# Altium schematic sheet MCU_STM32L051.SchDoc
size A4; SheetNumber: 3; SheetTotal: 7
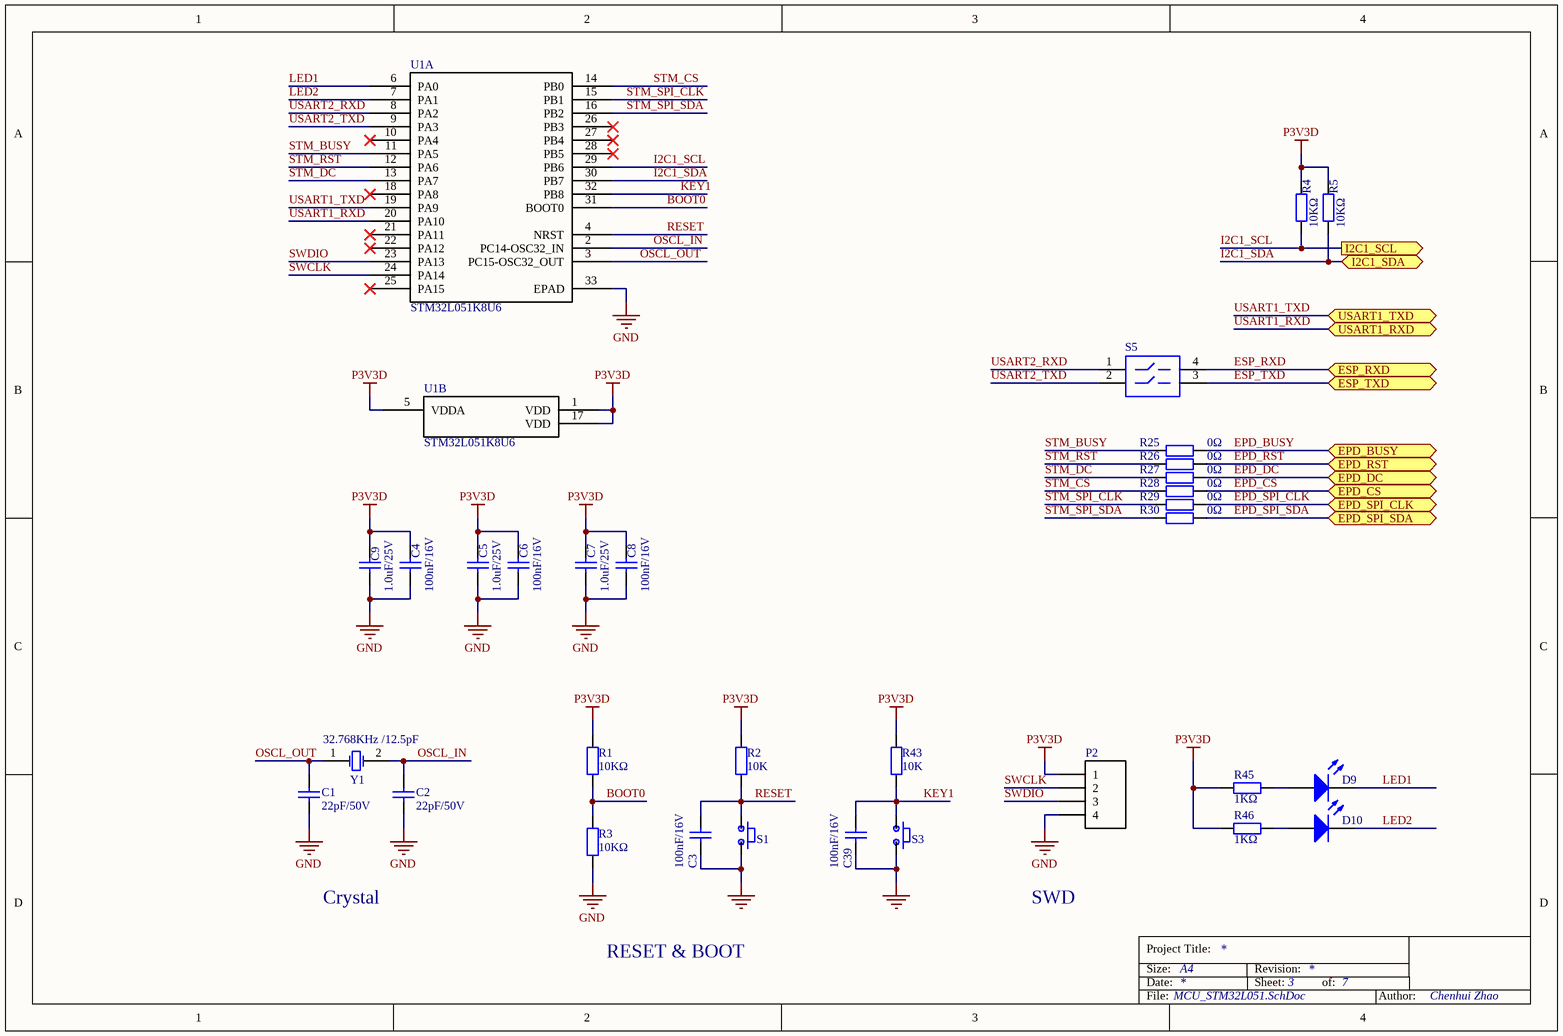
[diagram p0: MCU_STM32L051.SchDoc]

## Parts
C1  22pF/50V  [0402_C]
C2  22pF/50V  [0402_C]
C3  100nF/16V  [0402_C]
C4  100nF/16V  [0402_C]
C5  1.0uF/25V  [0402_C]
C6  100nF/16V  [0402_C]
C7  1.0uF/25V  [0402_C]
C8  100nF/16V  [0402_C]
C9  1.0uF/25V  [0402_C]
C39  100nF/16V  [0402_C]
D9  蓝灯 0603  [0603_LED_S1]  (value not drawn)
D10  蓝灯 0603  [0603_LED_S1]  (value not drawn)
P2  Header 4  [DIP4-2.00]  (value not drawn)
R1  10KΩ  [0402_R]
R2  10K  [0402_R]
R3  10KΩ  [0402_R]
R4  10KΩ  [0402_R]
R5  10KΩ  [0402_R]
R25  0Ω  [0402_R]
R26  0Ω  [0402_R]
R27  0Ω  [0402_R]
R28  0Ω  [0402_R]
R29  0Ω  [0402_R]
R30  0Ω  [0402_R]
R43  10K  [0402_R]
R45  1KΩ  [0402_R]
R46  1KΩ  [0402_R]
S1  Button  [SKRKAHE020]  (value not drawn)
S3  Button  [SKRKAHE020]  (value not drawn)
S5  拨码开关  [SW_SMT4]  (value not drawn)
U1  STM32L051K8U6  [UFQFPN32-5x5mm]  (parts A,B of 2)
Y1  32.768KHz /12.5pF  [SMD-3215_2P FC - 135]

## Ports
EPD_BUSY (bidir), EPD_CS (bidir), EPD_DC (bidir), EPD_RST (bidir), EPD_SPI_CLK (bidir), EPD_SPI_SDA (bidir), ESP_RXD (bidir), ESP_TXD (bidir), I2C1_SCL (out), I2C1_SDA (bidir), USART1_RXD (bidir), USART1_TXD (bidir)

## Nets
GND: C1.1 C2.1 C3.1 C4.1 C5.1 C6.1 C7.1 C8.1 C9.1 C39.1 P2.4 R3.1 S1.2 S3.2 U1.33(EPAD)
P3V3D: C4.2 C5.2 C6.2 C7.2 C8.2 C9.2 P2.1 R1.2 R2.2 R4.2 R5.2 R43.2 R45.2 R46.2 U1.1(VDD) U1.5(VDDA) U1.17(VDD)
BOOT0: R1.1 R3.2 U1.31(BOOT0)
EPD_BUSY: R25.2 ; port EPD_BUSY
EPD_CS: R28.2 ; port EPD_CS
EPD_DC: R27.2 ; port EPD_DC
EPD_RST: R26.2 ; port EPD_RST
EPD_SPI_CLK: R29.2 ; port EPD_SPI_CLK
EPD_SPI_SDA: R30.2 ; port EPD_SPI_SDA
ESP_RXD: S5.4 ; port ESP_RXD
ESP_TXD: S5.3 ; port ESP_TXD
I2C1_SCL: R4.1 U1.29(PB6) ; port I2C1_SCL
I2C1_SDA: R5.1 U1.30(PB7) ; port I2C1_SDA
KEY1: C39.2 R43.1 S3.1 U1.32(PB8)
LED1: D9.K U1.6(PA0)
LED2: D10.K U1.7(PA1)
OSCL_IN: C2.2 U1.2(PC14-OSC32_IN) Y1.2(OSC2)
OSCL_OUT: C1.2 U1.3(PC15-OSC32_OUT) Y1.1(OSC1)
RESET: C3.2 R2.1 S1.1 U1.4(NRST)
STM_BUSY: R25.1 U1.11(PA5)
STM_CS: R28.1 U1.14(PB0)
STM_DC: R27.1 U1.13(PA7)
STM_RST: R26.1 U1.12(PA6)
STM_SPI_CLK: R29.1 U1.15(PB1)
STM_SPI_SDA: R30.1 U1.16(PB2)
SWCLK: P2.2 U1.24(PA14)
SWDIO: P2.3 U1.23(PA13)
USART1_RXD: U1.20(PA10) ; port USART1_RXD
USART1_TXD: U1.19(PA9) ; port USART1_TXD
USART2_RXD: S5.1 U1.8(PA2)
USART2_TXD: S5.2 U1.9(PA3)
NetD9_A: D9.A R45.1
NetD10_A: D10.A R46.1

Not connected (* = marked no-connect by the designer): U1 10(PA4)* 18(PA8)* 21(PA11)* 22(PA12)* 25(PA15)* 26(PB3)* 27(PB4)* 28(PB5)*

## Notes on the sheet
- Crystal
- SWD
- RESET & BOOT
- Date:
- Size:
- Project Title:
- A4
- Revision:
- Sheet:
- of:
- File:
- Author:
- Chenhui Zhao

## Library data of the parts
C1 C2 = 0402 22pF (220) 5% 50V: 贴片电容; ComponentLink1Description: 供应商链接; ComponentLink1URL: http://www.szlcsc.com/product/details_1907.html; Package: 0402; Supplier: LC; SuppliersPartNumber: C1555
C3 C4 C6 C8 C39 = 0402 100nF (104) 10% 16V: 贴片电容; ComponentLink1Description: 供应商链接; ComponentLink1URL: http://www.szlcsc.com/product/details_1877.html; Package: 0402; Supplier: LC; SuppliersPartNumber: C1525
C5 C7 C9 = 0402 1.0uF (105) 10% 25V: 贴片电容; ComponentLink1Description: 供应商链接; ComponentLink1URL: http://www.szlcsc.com/product/details_53938.html; Package: 0402; Supplier: LC; SuppliersPartNumber: C52923
D9 D10 = 0603 蓝灯: 发光二极管; ComponentLink1Description: 供应商链接; ComponentLink1URL: http://www.szlcsc.com/product/details_73150.html; Package: 0603; Supplier: LC; SuppliersPartNumber: C72041
P2 = Header 4: Header, 4-Pin; LatestRevisionDate: 17-Jul-2002; LatestRevisionNote: Re-released for DXP Platform.; Publisher: Altium Limited
R1-R5 R43 = 0402 10KΩ (1002) 1%: 贴片电阻; ComponentLink1Description: 供应商链接; ComponentLink1URL: http://www.szlcsc.com/product/details_26487.html; Package: 0402; Supplier: LC; SuppliersPartNumber: C25744
R25-R30 = 0402 0Ω (0R0) 1%: 贴片电阻; ComponentLink1Description: 供应商链接; ComponentLink1URL: http://www.szlcsc.com/product/details_17853.html; Package: 0402; Supplier: LC; SuppliersPartNumber: C17168
R45 R46 = 0402 1KΩ (1001) 1%: 贴片电阻; ComponentLink1Description: 供应商链接; ComponentLink1URL: http://www.szlcsc.com/product/details_12256.html; Package: 0402; Supplier: LC; SuppliersPartNumber: C11702
S5 = SW-SMT2: SMT Switch, 4 Position, SPST
U1 = STM32L051K8U6: Ultra-low-power Arm Cortex-M0+ MCU with 64 Kbytes of Flash memory, 32 MHz CPU; Vendor: STMicroelectronics; Built_By: EMA_UL_Team; SourceLibrary: Updates_to_database_2020-10-19; Manufacturer_Part_Number: STM32L051K8U6; Copyright: Copyright (C) 2018 Accelerated Designs. All rights reserved; RefDes: RefDes; Type: DEV
Y1 = SMD-3215_2P 32.768KHz 20ppm 12.5pF: 贴片晶振; ComponentLink1Description: 供应商链接; ComponentLink1URL: http://www.szlcsc.com/product/details_33310.html; Package: SMD-3215_2P; Supplier: LC; SuppliersPartNumber: C32346